# Altium schematic sheet master.SchDoc
size A4
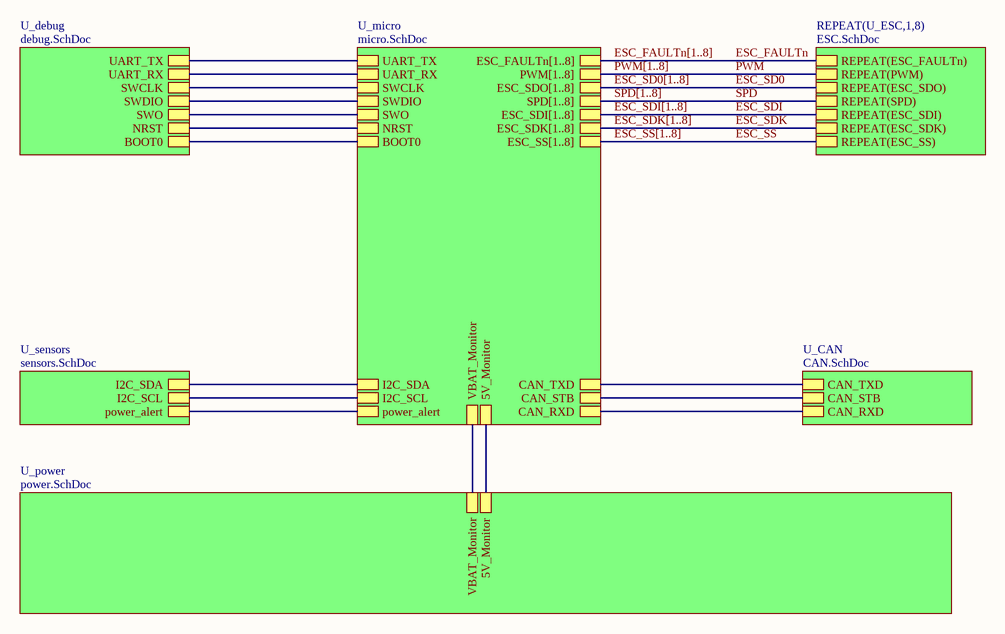
[diagram p0: master.SchDoc]

## Sub-sheets
REPEAT(U_ESC,1,8) = ESC.SchDoc: REPEAT(ESC_FAULTn), REPEAT(PWM), REPEAT(ESC_SDO), REPEAT(SPD), REPEAT(ESC_SDI), REPEAT(ESC_SDK), REPEAT(ESC_SS)
U_CAN = CAN.SchDoc: CAN_TXD, CAN_STB, CAN_RXD
U_debug = debug.SchDoc: UART_TX, UART_RX, SWCLK, SWDIO, SWO, NRST, BOOT0
U_micro = micro.SchDoc: UART_TX, ESC_SS[1..8], UART_RX, ESC_FAULTn[1..8], SPD[1..8], PWM[1..8], CAN_STB, ESC_SDK[1..8], ESC_SDI[1..8], I2C_SDA, I2C_SCL, CAN_TXD, CAN_RXD, ESC_SDO[1..8], SWO, SWCLK, SWDIO, NRST, BOOT0, power_alert, VBAT_Monitor, 5V_Monitor
U_power = power.SchDoc: VBAT_Monitor, 5V_Monitor
U_sensors = sensors.SchDoc: I2C_SDA, I2C_SCL, power_alert

## Nets
ESC_FAULTn: sheet REPEAT(U_ESC,1,8)/REPEAT(ESC_FAULTn)
ESC_SD0: sheet REPEAT(U_ESC,1,8)/REPEAT(ESC_SDO)
ESC_SDI: sheet REPEAT(U_ESC,1,8)/REPEAT(ESC_SDI)
ESC_SDK: sheet REPEAT(U_ESC,1,8)/REPEAT(ESC_SDK)
ESC_SS: sheet REPEAT(U_ESC,1,8)/REPEAT(ESC_SS)
PWM: sheet REPEAT(U_ESC,1,8)/REPEAT(PWM)
SPD: sheet REPEAT(U_ESC,1,8)/REPEAT(SPD)
(unnamed): sheet U_CAN/CAN_TXD, sheet U_micro/CAN_TXD
(unnamed): sheet U_CAN/CAN_STB, sheet U_micro/CAN_STB
(unnamed): sheet U_CAN/CAN_RXD, sheet U_micro/CAN_RXD
(unnamed): sheet U_micro/UART_TX, sheet U_debug/UART_TX
(unnamed): sheet U_micro/UART_RX, sheet U_debug/UART_RX
(unnamed): sheet U_micro/I2C_SDA, sheet U_sensors/I2C_SDA
(unnamed): sheet U_micro/I2C_SCL, sheet U_sensors/I2C_SCL
(unnamed): sheet U_micro/SWO, sheet U_debug/SWO
(unnamed): sheet U_micro/SWCLK, sheet U_debug/SWCLK
(unnamed): sheet U_micro/SWDIO, sheet U_debug/SWDIO
(unnamed): sheet U_micro/NRST, sheet U_debug/NRST
(unnamed): sheet U_micro/BOOT0, sheet U_debug/BOOT0
(unnamed): sheet U_micro/power_alert, sheet U_sensors/power_alert
(unnamed): sheet U_micro/VBAT_Monitor, sheet U_power/VBAT_Monitor
(unnamed): sheet U_micro/5V_Monitor, sheet U_power/5V_Monitor

## Buses and harness runs
bus ESC_FAULTn[1..8] = sheet U_micro/ESC_FAULTn[1..8]
bus ESC_SD0[1..8] = sheet U_micro/ESC_SDO[1..8]
bus ESC_SDI[1..8] = sheet U_micro/ESC_SDI[1..8]
bus ESC_SDK[1..8] = sheet U_micro/ESC_SDK[1..8]
bus ESC_SS[1..8] = sheet U_micro/ESC_SS[1..8]
bus PWM[1..8] = sheet U_micro/PWM[1..8]
bus SPD[1..8] = sheet U_micro/SPD[1..8]